# EAGLE schematic Main scheme (EAGLE 9.1.3)
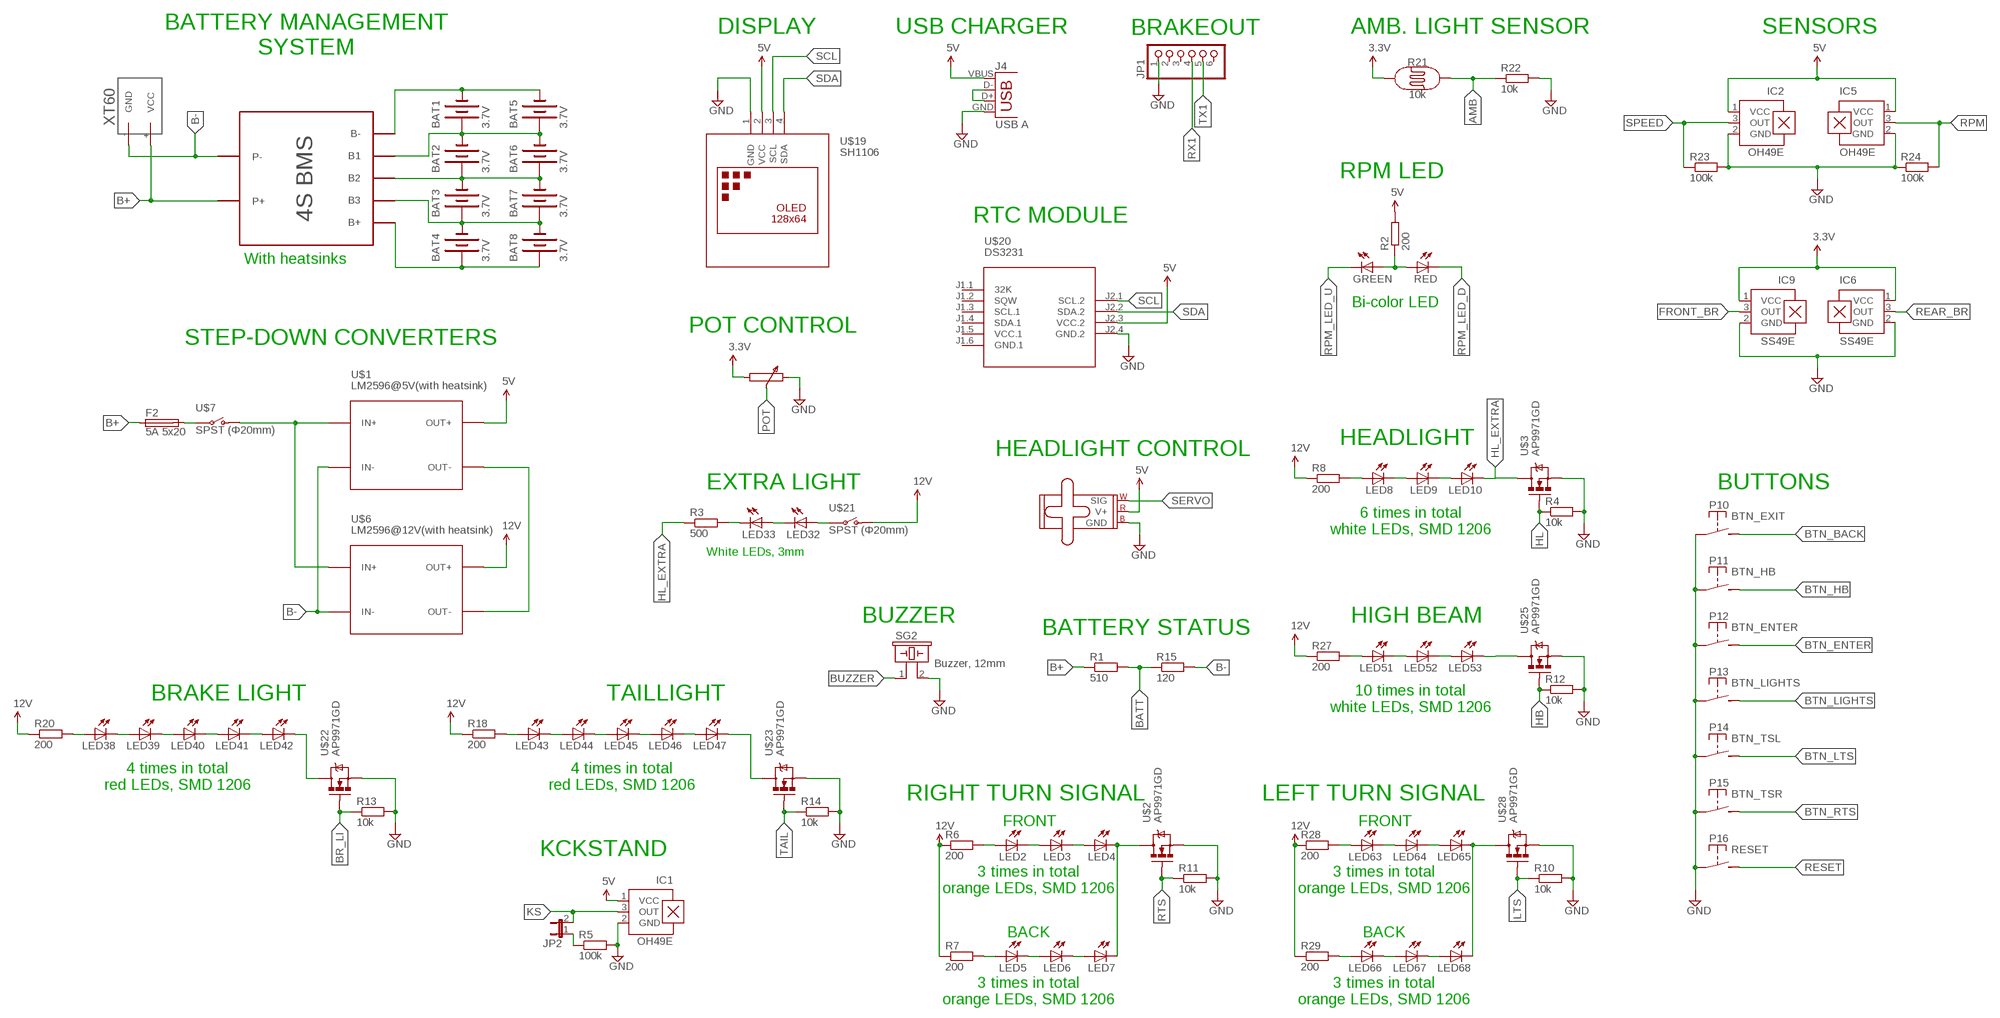
[diagram p0: schematic, sheet 1]

## Parts
BAT1  3.7V  BATTERY18650  [BATTERY_18650-HOLDER]
BAT2  3.7V  BATTERY18650  [BATTERY_18650-HOLDER]
BAT3  3.7V  BATTERY18650  [BATTERY_18650-HOLDER]
BAT4  3.7V  BATTERY18650  [BATTERY_18650-HOLDER]
BAT5  3.7V  BATTERY18650  [BATTERY_18650-HOLDER]
BAT6  3.7V  BATTERY18650  [BATTERY_18650-HOLDER]
BAT7  3.7V  BATTERY18650  [BATTERY_18650-HOLDER]
BAT8  3.7V  BATTERY18650  [BATTERY_18650-HOLDER]
F2  5A 5x20  GSH15  [GSH15]
GREEN  LED5MM  [LED5MM]
IC1  OH49E  A1301UA  [SIP3-UA]
IC2  OH49E  A1301UA  [SIP3-UA]
IC5  OH49E  A1301UA  [SIP3-UA]
IC6  SS49E  A1301UA  [SIP3-UA]
IC9  SS49E  A1301UA  [SIP3-UA]
J4  USB A  USB-A-H  [USB-A-H]
JP1  PINHD-1X6  [1X06]
JP2  JP1E  [JP1]
LED2  LED5MM  [LED5MM]
LED3  LED5MM  [LED5MM]
LED4  LED5MM  [LED5MM]
LED5  LED5MM  [LED5MM]
LED6  LED5MM  [LED5MM]
LED7  LED5MM  [LED5MM]
LED8  LED5MM  [LED5MM]
LED9  LED5MM  [LED5MM]
LED10  LED5MM  [LED5MM]
LED32  LED5MM  [LED5MM]
LED33  LED5MM  [LED5MM]
LED38  LED5MM  [LED5MM]
LED39  LED5MM  [LED5MM]
LED40  LED5MM  [LED5MM]
LED41  LED5MM  [LED5MM]
LED42  LED5MM  [LED5MM]
LED43  LED5MM  [LED5MM]
LED44  LED5MM  [LED5MM]
LED45  LED5MM  [LED5MM]
LED46  LED5MM  [LED5MM]
LED47  LED5MM  [LED5MM]
LED51  LED5MM  [LED5MM]
LED52  LED5MM  [LED5MM]
LED53  LED5MM  [LED5MM]
LED63  LED5MM  [LED5MM]
LED64  LED5MM  [LED5MM]
LED65  LED5MM  [LED5MM]
LED66  LED5MM  [LED5MM]
LED67  LED5MM  [LED5MM]
LED68  LED5MM  [LED5MM]
M2  SMALL_SERVO  [1X03]
P10  BTN_EXIT  FSM  [FSM]
P11  BTN_HB  FSM  [FSM]
P12  BTN_ENTER  FSM  [FSM]
P13  BTN_LIGHTS  FSM  [FSM]
P14  BTN_TSL  FSM  [FSM]
P15  BTN_TSR  FSM  [FSM]
P16  RESET  FSM  [FSM]
R1  510  R-EU_0207/10  [0207/10]
R2  200  R-EU_0207/10  [0207/10]
R3  500  R-EU_0207/10  [0207/10]
R4  10k  R-EU_0207/10  [0207/10]
R5  100k  R-EU_0204/5  [0204/5]
R6  200  R-EU_0207/10  [0207/10]
R7  200  R-EU_0207/10  [0207/10]
R8  200  R-EU_0207/10  [0207/10]
R10  10k  R-EU_0207/10  [0207/10]
R11  10k  R-EU_0207/10  [0207/10]
R12  10k  R-EU_0207/10  [0207/10]
R13  10k  R-EU_0207/10  [0207/10]
R14  10k  R-EU_0207/10  [0207/10]
R15  120  R-EU_0207/10  [0207/10]
R18  200  R-EU_0207/10  [0207/10]
R20  200  R-EU_0207/10  [0207/10]
R21  10k  PHOTOCELLPTH  [PHOTOCELL]
R22  10k  R-EU_0207/10  [0207/10]
R23  100k  R-EU_0204/5  [0204/5]
R24  100k  R-EU_0204/5  [0204/5]
R27  200  R-EU_0207/10  [0207/10]
R28  200  R-EU_0207/10  [0207/10]
R29  200  R-EU_0207/10  [0207/10]
RED  LED5MM  [LED5MM]
SG2  Buzzer, 12mm  B/C11L  [B/C11L]
U$1  LM2596@5V(with heatsink)  DC-DC-STEP-DOWN-LM2596  [DC-DC-STEP-DOWN-LM2596]
U$2  AP9971GD  IRFZ44N  [TO-220]
U$3  AP9971GD  IRFZ44N  [TO-220]
U$5  XT60  [XT60]
U$6  LM2596@12V(with heatsink)  DC-DC-STEP-DOWN-LM2596  [DC-DC-STEP-DOWN-LM2596]
U$7  SPST (Φ20mm)  SWITCH-SPST-2TV  [SWITCH-SPST-VERTICAL]
U$19  SH1106  DISPLAY-OLED-128X64-I2C  [DISPLAY-OLED-128X64-I2C]
U$20  DS3231  RTC-DS3231-AT24C32  [RTC-DS3231-AT24C32]
U$21  SPST (Φ20mm)  SWITCH-SPST-2TV  [SWITCH-SPST-VERTICAL]
U$22  AP9971GD  IRFZ44N  [TO-220]
U$23  AP9971GD  IRFZ44N  [TO-220]
U$25  AP9971GD  IRFZ44N  [TO-220]
U$28  AP9971GD  IRFZ44N  [TO-220]

## Nets
AMB: R21.2 R22.1
B+: F2.1 R1.1 U$5.+(VCC)
B-: R15.2 U$1.IN- U$5.-(GND) U$6.IN-
BATT: R1.2 R15.1
BR_LEDS: LED42.K(C) U$22.2(D)
BR_LI: R13.1 U$22.1(G)
BTN_BACK: P10.P$2(S)
BTN_ENTER: P12.P$2(S)
BTN_HB: P11.P$2(S)
BTN_LIGHTS: P13.P$2(S)
BTN_LTS: P14.P$2(S)
BTN_RTS: P15.P$2(S)
BUZZER: SG2.1
FRONT_BR: IC9.3(OUT)
GND: IC1.2(GND) IC2.2(GND) IC5.2(GND) IC6.2(GND) IC9.2(GND) J4.GND JP1.1 M2.3(GND) P10.P$1(P) P11.P$1(P) P12.P$1(P) P13.P$1(P) P14.P$1(P) P15.P$1(P) P16.P$1(P) R4.2 R5.2 R10.2 R11.2 R12.2 R13.2 R14.2 R22.2 R23.2 R24.1 SG2.2 U$2.3(S) U$3.3(S) U$19.1(GND) U$20.J2.4(GND.2) U$22.3(S) U$23.3(S) U$25.3(S) U$28.3(S)
HB: R12.1 U$25.1(G)
HB_LEDS: LED53.K(C) U$25.2(D)
HB_LEDS1: U$3.2(D)
HL: R4.1 U$3.1(G)
HL_EXTRA: LED10.K(C) LED33.K(C) R3.1 R3.2
KS: IC1.3(OUT) JP2.2
LTS: R10.1 U$28.1(G)
N$1: GREEN.A R2.1 RED.A
N$3: JP2.1 R5.1
N$4: F2.2 U$7.2(P)
N$5: LED2.A R6.2
N$6: LED2.K(C) LED3.A
N$7: LED3.K(C) LED4.A
N$8: LED5.A R7.2
N$9: LED5.K(C) LED6.A
N$10: LED6.K(C) LED7.A
N$11: LED8.A R8.2
N$12: LED8.K(C) LED9.A
N$13: LED9.K(C) LED10.A
N$17: U$1.IN+ U$6.IN+ U$7.1(O)
N$19: BAT1.PWR@1(+) BAT2.GND@1(-) BAT5.PWR@1(+) BAT6.GND@1(-)
N$20: BAT2.PWR@1(+) BAT3.GND@1(-) BAT6.PWR@1(+) BAT7.GND@1(-)
N$21: BAT3.PWR@1(+) BAT4.GND@1(-) BAT7.PWR@1(+) BAT8.GND@1(-)
N$22: BAT1.GND@1(-) BAT5.GND@1(-)
N$23: BAT4.PWR@1(+) BAT8.PWR@1(+)
N$25: U$1.OUT- U$6.OUT-
N$39: LED32.K(C) LED33.A
N$40: LED32.A U$21.2(P)
N$41: U$21.1(O)
N$47: J4.D+ J4.D-
N$48: LED38.A R20.2
N$52: LED38.K(C) LED39.A
N$53: LED39.K(C) LED40.A
N$54: LED40.K(C) LED41.A
N$55: LED41.K(C) LED42.A
N$56: LED43.A R18.2
N$57: LED43.K(C) LED44.A
N$58: LED44.K(C) LED45.A
N$59: LED45.K(C) LED46.A
N$60: LED46.K(C) LED47.A
N$64: LED51.A R27.2
N$65: LED51.K(C) LED52.A
N$69: LED52.K(C) LED53.A
N$79: LED63.A R28.2
N$80: LED63.K(C) LED64.A
N$81: LED64.K(C) LED65.A
N$82: LED66.A R29.2
N$83: LED66.K(C) LED67.A
N$84: LED67.K(C) LED68.A
REAR_BR: IC6.3(OUT)
RESET: P16.P$2(S)
RPM: IC5.3(OUT) R24.2
RPM_LED_D: RED.K(C)
RPM_LED_U: GREEN.K(C)
RTS: R11.1 U$2.1(G)
RX1: JP1.4
SCL: U$19.3(SCL) U$20.J2.1(SCL.2)
SDA: U$19.4(SDA) U$20.J2.2(SDA.2)
SERVO: M2.1(SIG)
SPEED: IC2.3(OUT) R23.1
TAIL: R14.1 U$23.1(G)
TL_LEDS: LED47.K(C) U$23.2(D)
TSL_LEDS: LED65.K(C) LED68.K(C) U$28.2(D)
TSL_LEDS1: LED4.K(C) LED7.K(C) U$2.2(D)
TX1: JP1.5
VCC: IC1.1(VCC) IC2.1(VCC) IC5.1(VCC) IC6.1(VCC) IC9.1(VCC) J4.VBUS M2.2(V+) R2.2 R6.1 R7.1 R8.1 R18.1 R20.1 R21.1 R27.1 R28.1 R29.1 U$1.OUT+ U$6.OUT+ U$19.2(VCC) U$20.J2.3(VCC.2) ; supply symbol labelled 5V, 3.3V, 12V
Unconnected: JP1.2 JP1.3 JP1.6 U$20.J1.1(32K) U$20.J1.2(SQW) U$20.J1.3(SCL.1) U$20.J1.4(SDA.1)

## Notes on the sheet
- BATTERY MANAGEMENT
  SYSTEM
- DISPLAY | USB CHARGER | BRAKEOUT | AMB. LIGHT SENSOR | SENSORS
- B-
- P- | B1
- 4S BMS | RPM LED
- B2
- P+ | B3
- RTC MODULE
- B+
- With heatsinks
- Bi-color LED
- POT CONTROL
- STEP-DOWN CONVERTERS
- HEADLIGHT
- HEADLIGHT CONTROL
- EXTRA LIGHT | BUTTONS
- 6 times in total
  white LEDs, SMD 1206
- White LEDs, 3mm
- BUZZER | HIGH BEAM
- BATTERY STATUS
- 10 times in total
  white LEDs, SMD 1206
- BRAKE LIGHT | TAILLIGHT
- 4 times in total
  red LEDs, SMD 1206
- 4 times in total
  red LEDs, SMD 1206
- RIGHT TURN SIGNAL | LEFT TURN SIGNAL
- FRONT | FRONT
- KCKSTAND
- 3 times in total
  orange LEDs, SMD 1206
- 3 times in total
  orange LEDs, SMD 1206
- BACK | BACK
- 3 times in total
  orange LEDs, SMD 1206
- 3 times in total
  orange LEDs, SMD 1206

## Power pins joined to a net without a drawn wire
GND.1: U$20.J1.6(GND.1)
VCC.1: U$20.J1.5(VCC.1)

## Library data of the parts
BAT1-BAT8 = SparkFun-Electromechanical:BATTERY: Battery Holders Various common sizes : AA, AAA, 18650 (PRT-12895), 20mm coin cell and 12mm coin cell. 20MM_4LEGS, BATT-10373
F2 = fuse:GSH15: FUSE HOLDER grid 15mm, 19649 Wickmann; MPN: 64900001039; OC_FARNELL: 1271673; OC_NEWARK: 02P0318
GREEN RED = adafruit:LED: LED
IC1 IC2 IC5 IC6 IC9 = allegro:A13*?: Linear Hall Effect Sensor ICs Continuous-Time Ratiometric High-Temperature Operation Programmable Linear with Analog Output A1302 -Replacement- UGN3503 Source: http://www.allegromicro.com/en/Products/Part_Numbers/1301/1301.pdf http://www.allegromicro.com/en/Products/Part_Numbers/1321/1321.pdf http://www.allegromicro.com/en/Products/Part_Numbers/1381/1381.pdf; MF: ALLEGRO MICROSYSTEMS, INC.; MPN: A1301EUA-T; OC_FARNELL: 1198085; OC_NEWARK: 31K6635
J4 = SparkFun-Connectors:USB: USB Connectors USB-B-PTH is fully proven SKU : PRT-00139/CONN-08278 USB-miniB is fully proven SKU : PRT-00587 USB-A-PCB is untested. USB-A-H is throughly reviewed, but untested. Spark Fun Electronics SKU : PRT-00437 USB-B-SMT is throughly reviewed, but untested. Needs silkscreen touching up. USB-A-S has not been used/tested USB-MB-H has not been used/tested USB-MICROB has been used. CONN-09505; PROD_ID: CONN-08367
JP1 = pinhead:PINHD-1X6: PIN HEADER
JP2 = jumper:JP1E: JUMPER
LED2-LED10 LED32 LED33 LED38-LED47 LED51-LED53 LED63-LED68 = led:LED: LED
M2 = SparkFun-Electromechanical:SMALL_SERVO: Small servo motor This is the small servo used in the SIK. SKU: ROB-09065
P10-P16 = switch-misc:FSM: TYCO SWITCH
R1-R4 R6-R8 R10-R15 R18 R20 R22 R27-R29 = resistor:R-EU_: RESISTOR, European symbol
R5 R23 R24 = rcl:R-EU_: RESISTOR, European symbol; SPICEPREFIX: R
R21 = SparkFun-Sensors:PHOTOCELL: Photocell (Photodetector, Photo Resistor, CdS) This is a very small light sensor. A photocell changes (also called a photodetector, photo resistor, CdS or photoconductive cell) resistance depending on the amount of light it is exposed to. These little sensors make great ambient light triggers (when light in the room turns on, do something). Datasheet <http://cdn.sparkfun.com/datasheets/Sensors/LightImaging/SEN-09088.pdf> SparkFun Products Mini Photocell <https://www.sparkfun.com/products/9088> (SEN-09088); PROD_ID: COMP-09129; SF_ID: SEN-09088
SG2 = buzzer:B/C11L: BUZZER Source: Buerklin; OC_FARNELL: unknown; OC_NEWARK: unknown
U$1 U$6 = diy-modules:DC-DC-STEP-DOWN-LM2596: DC/DC Step-Down Regulator based on LM2596-ADJ chip LM2596 datasheet available here: http://www.ti.com/lit/ds/symlink/lm2596.pdf Click here to find device on ebay.com <http://www.ebay.com/sch/lm2596+power+regulator>
U$2 U$3 U$22 U$23 U$25 U$28 = IRFZ44N:IRFZ44N; AVAILABILITY: Unavailable; DESCRIPTION: Transistor NPN Field Effect IRFZ44/IRFZ44N INTERNATIONAL RECTIFIER Ampere=46 V=250 TO220; MF: International Rectifier; MP: IRFZ44N; PACKAGE: TO-220 International Rectifier; PRICE: None
U$5 = XT60:XT60: XT60
U$7 U$21 = SparkFun:SWITCH-SPST-2
U$19 = diy-modules:DISPLAY-OLED-128X64-I2C: 128x64 Dot Matrix OLED Module based on SSD1306 chip Variant with I2C interface More details available here: http://www.instructables.com/id/Monochrome-096-i2c-OLED-display-with-arduino-SSD13/ SSD1306 datasheet: https://cdn-shop.adafruit.com/datasheets/SSD1306.pdf Click here to find device on ebay.com <http://www.ebay.com/sch/oled+display+128x64+iic> Note: There are two variants: I2C and SPI. Search for the proper version.
U$20 = diy-modules:RTC-DS3231-AT24C32: RTC Module with Battery and EEPROM based on DS3231 and AT24C32 chips Tutorial can be found here: https://edwardmallon.wordpress.com/2014/05/21/using-a-cheap-3-ds3231-rtc-at24c32-eeprom-from-ebay/ Click here to find device on ebay.com <http://www.ebay.com/sch/DS3231+AT24C32+module>